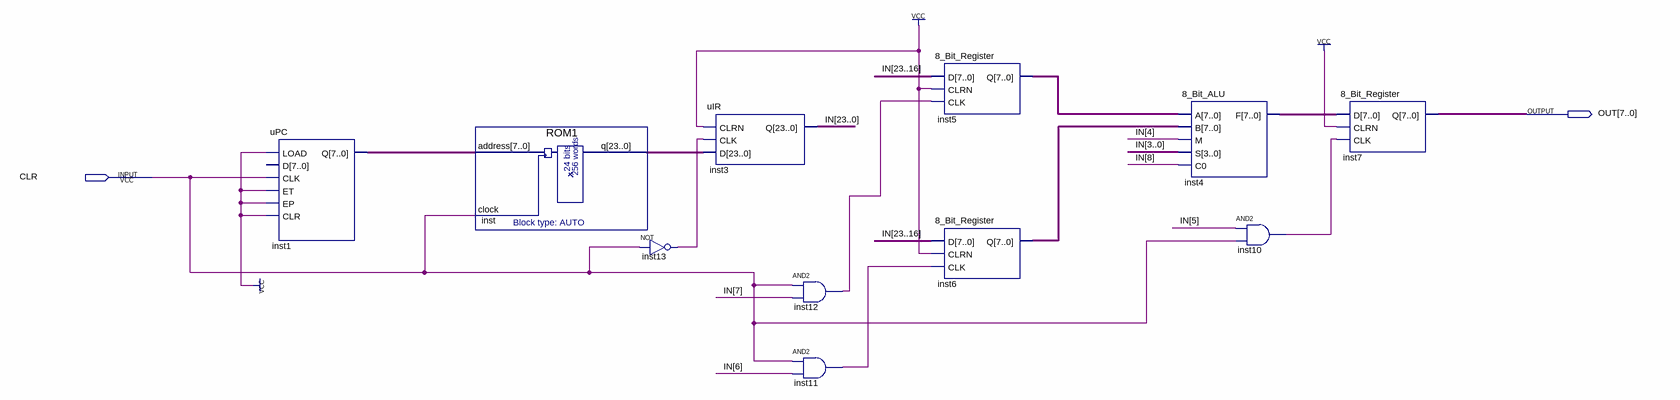
[diagram p0: schematic sheet]
// Quartus schematic LAB_1.bdf as structural Verilog: 11 symbols, 2 pins
module LAB_1 (
  input  CLR,
  output [7:0] OUT
);

  wire inst10_out, inst11_out, inst12_out, inst13_out;
  wire [7:0] inst1_q, inst4_f, inst5_q, inst6_q;
  wire [23:0] IN, inst_q;

  uPC inst1 (.LOAD(1'b1), .CLK(CLR), .ET(1'b1), .EP(1'b1), .CLR(1'b1), .Q(inst1_q));  // open: D
  ROM1 inst (.address(inst1_q), .clock(CLR), .q(inst_q));
  not inst13 (inst13_out, CLR);
  uIR inst3 (.CLRN(1'b1), .CLK(inst13_out), .D(inst_q), .Q(IN));
  and inst12 (inst12_out, CLR, IN[7]);
  and inst11 (inst11_out, CLR, IN[6]);
  \8_Bit_Register  inst5 (.D(IN[23:16]), .CLRN(1'b1), .CLK(inst12_out), .Q(inst5_q));
  \8_Bit_Register  inst6 (.D(IN[23:16]), .CLRN(1'b1), .CLK(inst11_out), .Q(inst6_q));
  \8_Bit_ALU  inst4 (.A(inst5_q), .B(inst6_q), .M(IN[4]), .S(IN[3:0]), .C0(IN[8]), .F(inst4_f));
  and inst10 (inst10_out, IN[5], CLR);
  \8_Bit_Register  inst7 (.D(inst4_f), .CLRN(1'b1), .CLK(inst10_out), .Q(OUT));
endmodule
